# Altium schematic sheet Schematic.SchDoc
size A; SheetNumber: 1; SheetTotal: 1
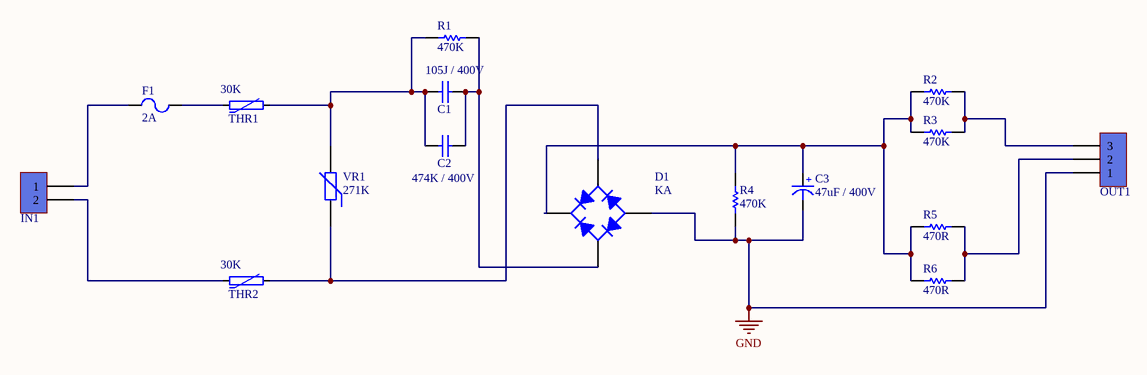
[diagram p0: Schematic.SchDoc]

## Parts
C1  105J / 400V  [CBB22]
C2  474K / 400V  [CBB22]
C3  47uF / 400V  [ELEC-CAP-RAD40-85]
D1  MODEL: KA  [GBJ]  (hidden comment: Bridge Diode)
F1  2A  [FUSE-Double PAD]
IN1  KF301_Terminal  [KF301 2PIN]  (value not drawn)
OUT1  KF301-3Pin Terminal  [KF301 3PIN]  (value not drawn)
R1  470K  [Axial 1W  7_0mm]
R2  470K  [Axial 1W  7_0mm]
R3  470K  [Axial 1W  7_0mm]
R4  470K  [Axial 1W  7_0mm]
R5  470R  [Axial 3W 9_0mm]
R6  470R  [Axial 3W 9_0mm]
THR1  30K  [NTC_10mm]
THR2  30K  [NTC_10mm]
VR1  271K  [20D XXX]

## Nets
GND: C3.1(-) D1.3(A) OUT1.1 R4.2
NetC1_1: C1.1 C2.1 R1.1 THR1.2 VR1.2
NetC1_2: C1.2 C2.2 D1.2(C) R1.2
NetC3_2: C3.2(+) D1.1(K) R2.1 R3.1 R4.1 R5.1 R6.1
NetD1_4: D1.4(C) THR2.2 VR1.1
NetF1_1: F1.1 IN1.1
NetF1_2: F1.2 THR1.1
NetIN1_2: IN1.2 THR2.1
NetOUT1_2: OUT1.2 R5.2 R6.2
NetOUT1_3: OUT1.3 R2.2 R3.2

## Library data of the parts
C1 C2 = Cap CBB22 105J400V: Polypropylene film with epoxy Cap CBB22 105J400V; Manufacturer: CHINA; Designer: Abbas Basereh; Data: 16-12-2016; Link: https://www.alibaba.com/product-detail/CBB22-capacitors-105J-400V-1UF-400V_60020643516.html; Part. No: 105J400V
C3 = Capacitor Electrolytic: Electrolytic Capacitor
D1 = Bridge Diode: Full Wave Bridge Diode
F1 = Fuse
IN1 = KF301-2Pin_Terminal: Terminal 2 Pin 250VAC 16A; Part. No: KF301 2P; Designer: Abbas Basereh; Link: https://www.aliexpress.com/item/
OUT1 = KF301-3Pin Terminal: Terminal 3 Pin 250VAC 16A; Part. No: KF301 3P; Designer: Abbas Basereh; Link: https://www.aliexpress.com/item/
R1-R4 = RES Axial 1W: Designer: Abbas Basereh; Desc.: RES Axial 1W; Data: 4-1-2017
R5 R6 = RES Axial 3W: Designer: Abbas Basereh; Desc.: RES Axial 3W; Data: 4-1-2017
THR1 THR2 = NTC
VR1 = VARISTOR (VDR): VARISTORS; Manufacturer: china-canada-philipina; Designer: Abbas Basereh; VALUE: xxDxxx; Models: MOV-VDR-COV; Data: 2017-1-5; Link: digikey.com; PUBLISHER: ABBAS BASEREH